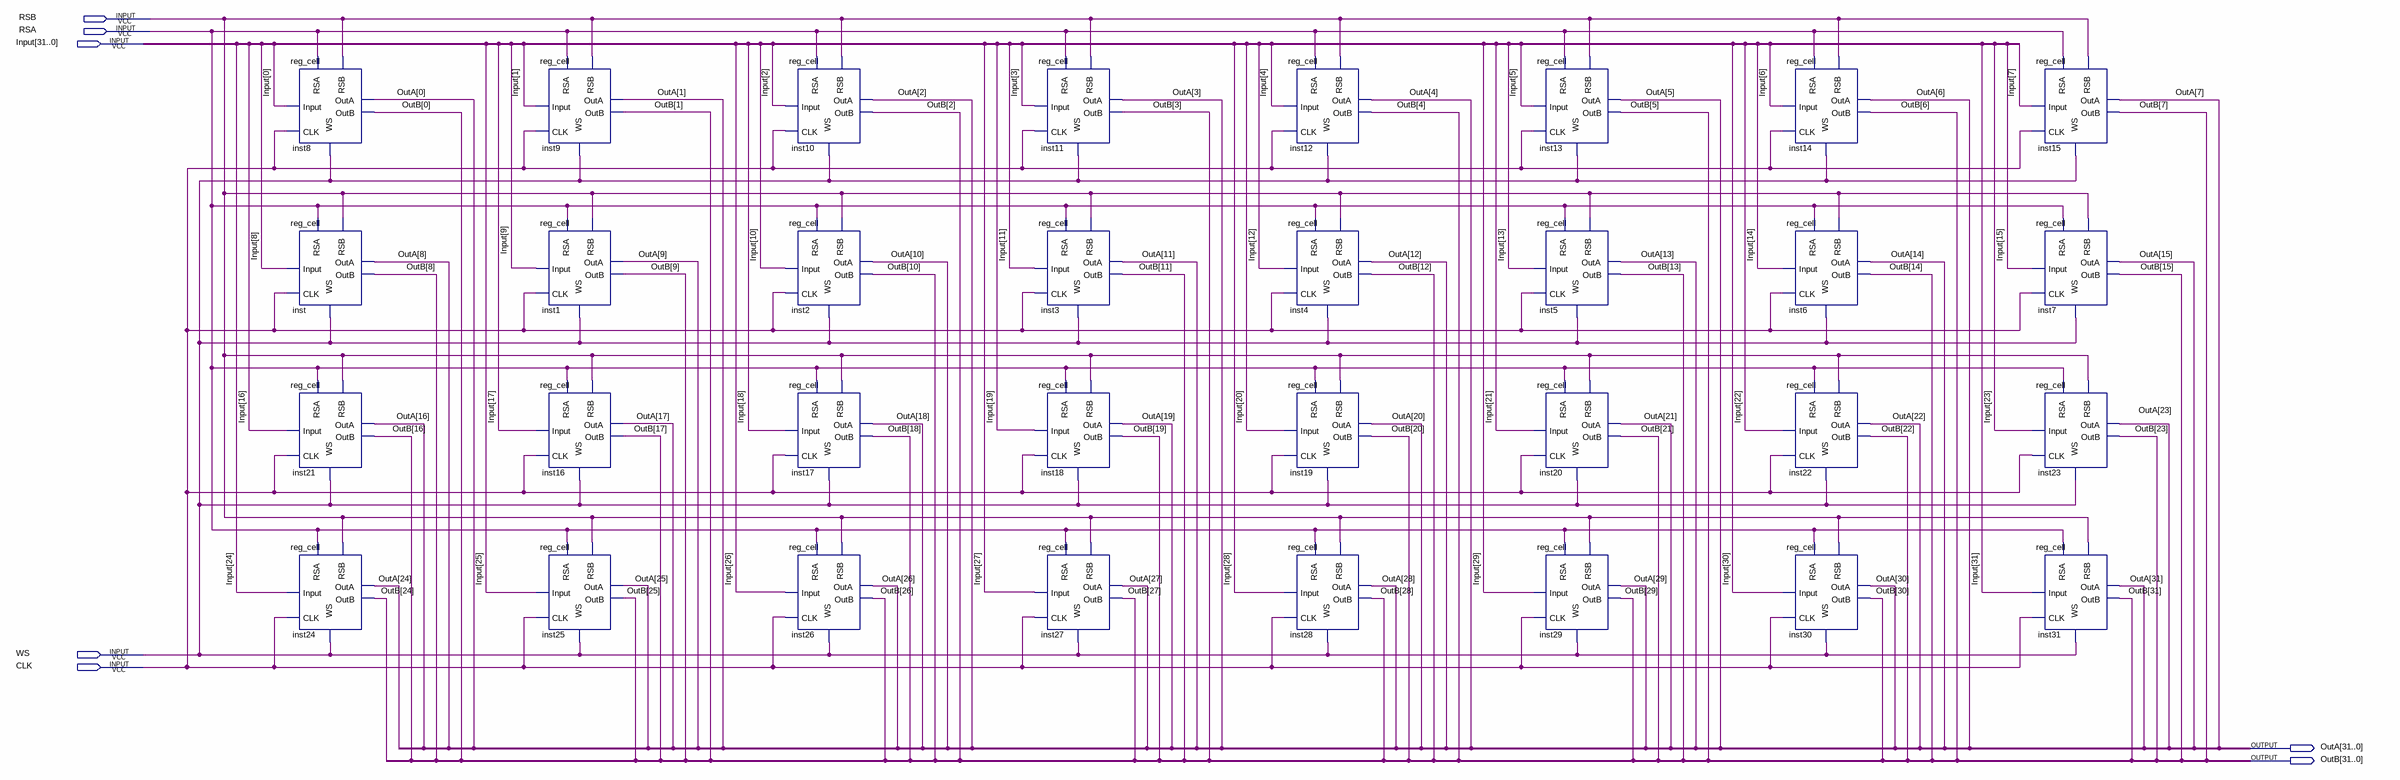
[diagram p0: schematic sheet]
// Quartus schematic regcell32.bdf as structural Verilog: 32 symbols, 7 pins
module regcell32 (
  input  RSB,
  input  RSA,
  input  [31:0] Input,
  input  WS,
  input  CLK,
  output [31:0] OutA,
  output [31:0] OutB
);

  reg_cell inst8 (.Input(Input[0]), .CLK(CLK), .WS(WS), .RSA(RSA), .RSB(RSB), .OutA(OutA[0]), .OutB(OutB[0]));
  reg_cell inst (.Input(Input[8]), .CLK(CLK), .WS(WS), .RSA(RSA), .RSB(RSB), .OutA(OutA[8]), .OutB(OutB[8]));
  reg_cell inst21 (.Input(Input[16]), .CLK(CLK), .WS(WS), .RSA(RSA), .RSB(RSB), .OutA(OutA[16]), .OutB(OutB[16]));
  reg_cell inst24 (.Input(Input[24]), .CLK(CLK), .WS(WS), .RSA(RSA), .RSB(RSB), .OutA(OutA[24]), .OutB(OutB[24]));
  reg_cell inst9 (.Input(Input[1]), .CLK(CLK), .WS(WS), .RSA(RSA), .RSB(RSB), .OutA(OutA[1]), .OutB(OutB[1]));
  reg_cell inst1 (.Input(Input[9]), .CLK(CLK), .WS(WS), .RSA(RSA), .RSB(RSB), .OutA(OutA[9]), .OutB(OutB[9]));
  reg_cell inst16 (.Input(Input[17]), .CLK(CLK), .WS(WS), .RSA(RSA), .RSB(RSB), .OutA(OutA[17]), .OutB(OutB[17]));
  reg_cell inst25 (.Input(Input[25]), .CLK(CLK), .WS(WS), .RSA(RSA), .RSB(RSB), .OutA(OutA[25]), .OutB(OutB[25]));
  reg_cell inst10 (.Input(Input[2]), .CLK(CLK), .WS(WS), .RSA(RSA), .RSB(RSB), .OutA(OutA[2]), .OutB(OutB[2]));
  reg_cell inst2 (.Input(Input[10]), .CLK(CLK), .WS(WS), .RSA(RSA), .RSB(RSB), .OutA(OutA[10]), .OutB(OutB[10]));
  reg_cell inst17 (.Input(Input[18]), .CLK(CLK), .WS(WS), .RSA(RSA), .RSB(RSB), .OutA(OutA[18]), .OutB(OutB[18]));
  reg_cell inst26 (.Input(Input[26]), .CLK(CLK), .WS(WS), .RSA(RSA), .RSB(RSB), .OutA(OutA[26]), .OutB(OutB[26]));
  reg_cell inst11 (.Input(Input[3]), .CLK(CLK), .WS(WS), .RSA(RSA), .RSB(RSB), .OutA(OutA[3]), .OutB(OutB[3]));
  reg_cell inst3 (.Input(Input[11]), .CLK(CLK), .WS(WS), .RSA(RSA), .RSB(RSB), .OutA(OutA[11]), .OutB(OutB[11]));
  reg_cell inst18 (.Input(Input[19]), .CLK(CLK), .WS(WS), .RSA(RSA), .RSB(RSB), .OutA(OutA[19]), .OutB(OutB[19]));
  reg_cell inst27 (.Input(Input[27]), .CLK(CLK), .WS(WS), .RSA(RSA), .RSB(RSB), .OutA(OutA[27]), .OutB(OutB[27]));
  reg_cell inst12 (.Input(Input[4]), .CLK(CLK), .WS(WS), .RSA(RSA), .RSB(RSB), .OutA(OutA[4]), .OutB(OutB[4]));
  reg_cell inst4 (.Input(Input[12]), .CLK(CLK), .WS(WS), .RSA(RSA), .RSB(RSB), .OutA(OutA[12]), .OutB(OutB[12]));
  reg_cell inst19 (.Input(Input[20]), .CLK(CLK), .WS(WS), .RSA(RSA), .RSB(RSB), .OutA(OutA[20]), .OutB(OutB[20]));
  reg_cell inst28 (.Input(Input[28]), .CLK(CLK), .WS(WS), .RSA(RSA), .RSB(RSB), .OutA(OutA[28]), .OutB(OutB[28]));
  reg_cell inst13 (.Input(Input[5]), .CLK(CLK), .WS(WS), .RSA(RSA), .RSB(RSB), .OutA(OutA[5]), .OutB(OutB[5]));
  reg_cell inst5 (.Input(Input[13]), .CLK(CLK), .WS(WS), .RSA(RSA), .RSB(RSB), .OutA(OutA[13]), .OutB(OutB[13]));
  reg_cell inst20 (.Input(Input[21]), .CLK(CLK), .WS(WS), .RSA(RSA), .RSB(RSB), .OutA(OutA[21]), .OutB(OutB[21]));
  reg_cell inst29 (.Input(Input[29]), .CLK(CLK), .WS(WS), .RSA(RSA), .RSB(RSB), .OutA(OutA[29]), .OutB(OutB[29]));
  reg_cell inst14 (.Input(Input[6]), .CLK(CLK), .WS(WS), .RSA(RSA), .RSB(RSB), .OutA(OutA[6]), .OutB(OutB[6]));
  reg_cell inst6 (.Input(Input[14]), .CLK(CLK), .WS(WS), .RSA(RSA), .RSB(RSB), .OutA(OutA[14]), .OutB(OutB[14]));
  reg_cell inst22 (.Input(Input[22]), .CLK(CLK), .WS(WS), .RSA(RSA), .RSB(RSB), .OutA(OutA[22]), .OutB(OutB[22]));
  reg_cell inst30 (.Input(Input[30]), .CLK(CLK), .WS(WS), .RSA(RSA), .RSB(RSB), .OutA(OutA[30]), .OutB(OutB[30]));
  reg_cell inst15 (.Input(Input[7]), .CLK(CLK), .WS(WS), .RSA(RSA), .RSB(RSB), .OutA(OutA[7]), .OutB(OutB[7]));
  reg_cell inst7 (.Input(Input[15]), .CLK(CLK), .WS(WS), .RSA(RSA), .RSB(RSB), .OutA(OutA[15]), .OutB(OutB[15]));
  reg_cell inst23 (.Input(Input[23]), .CLK(CLK), .WS(WS), .RSA(RSA), .RSB(RSB), .OutA(OutA[23]), .OutB(OutB[23]));
  reg_cell inst31 (.Input(Input[31]), .CLK(CLK), .WS(WS), .RSA(RSA), .RSB(RSB), .OutA(OutA[31]), .OutB(OutB[31]));
endmodule
